# Altium schematic sheet atmg32.SchDoc
size A; SheetNumber: 1; SheetTotal: 1
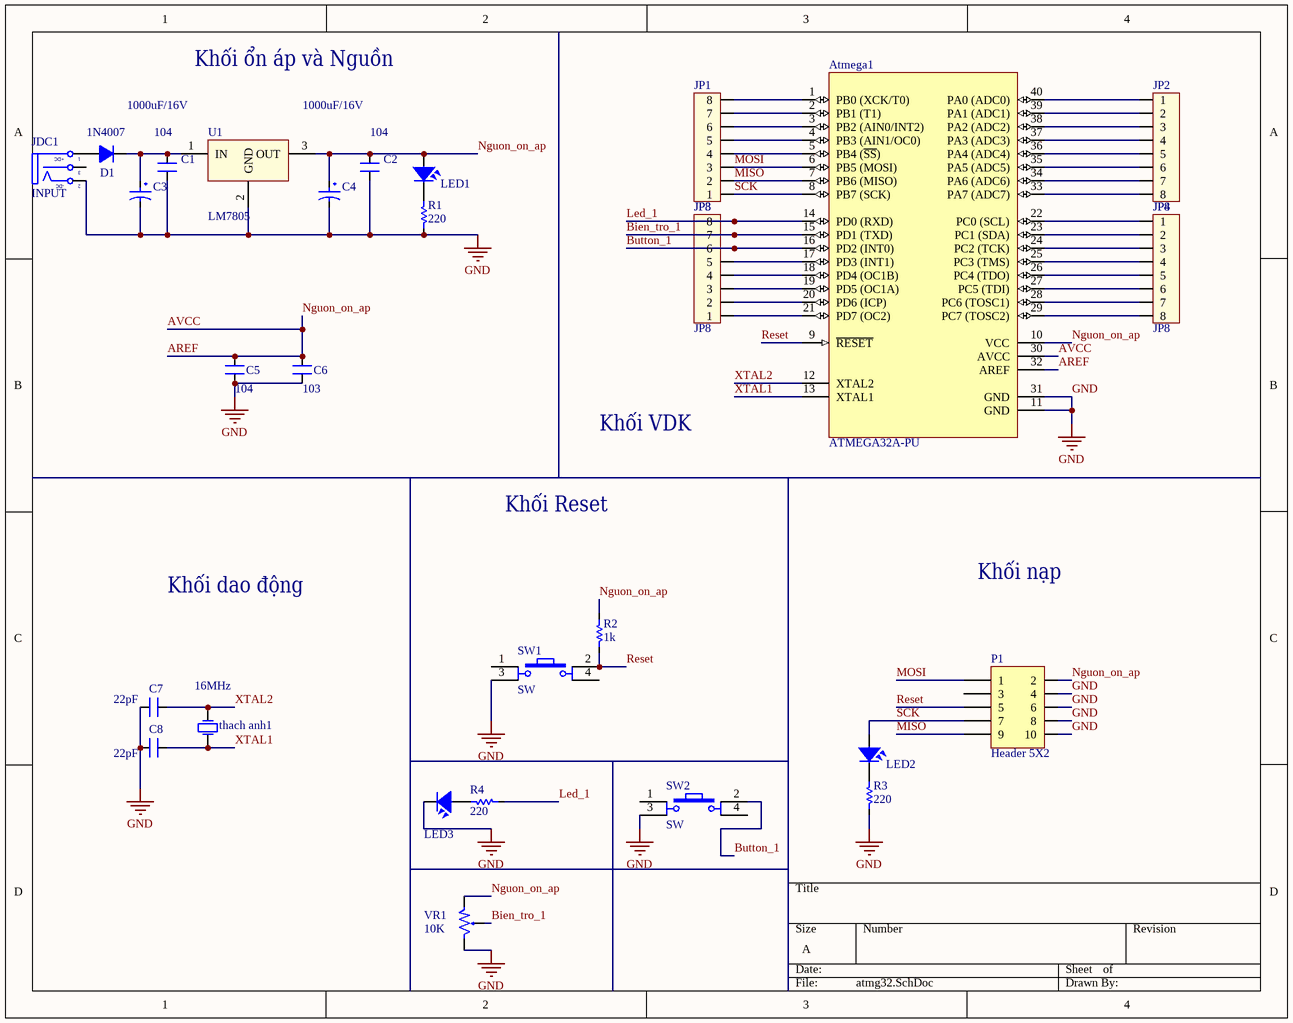
[diagram p0: atmg32.SchDoc]

## Parts
Atmega1  ATMEGA32A-PU  [DIP 40]
C1  104  [CN0]
C2  104  [CN0]
C3  1000uF/16V  [CAP 10x16x5 CURVE]
C4  1000uF/16V  [CAP 10x16x5 CURVE]
C5  104  [CN0]
C6  103  [CN0]
C7  22pF  [CN0]
C8  22pF  [CN0]
D1  1N4007  [1N4007]
JDC1  INPUT  [DC-IN]
JP1  JP8  [XH2.54-8P]
JP2  JP8  [XH2.54-8P]
JP3  JP8  [XH2.54-8P]
JP4  JP8  [XH2.54-8P]
LED1  LED  [LED-5MM-WHITE]  (value not drawn)
LED2  LED  [LED-5MM-WHITE]  (value not drawn)
LED3  LED  [LED-5MM-WHITE]  (value not drawn)
P1  Header 5X2  [HDR2X5]
R1  220  [RES-1/4W]
R2  1k  [RES-1/4W]
R3  220  [RES-1/4W]
R4  220  [RES-1/4W]
SW1  SW  [BUTTON 12x12x5 4P DIP]
SW2  SW  [BUTTON 12x12x5 4P DIP]
thach_anh1  16MHz  [CRYSTAL DIP]
U1  LM7805  [TO 220+Heatsink 21x15x10mm]
VR1  10K  [VR-RM065]

## Nets
GND: Atmega1.11(GND) Atmega1.31(GND) C1.1 C2.1 C3.2 C4.2 C5.1 C6.1 C7.2 C8.2 JDC1.2(TN) LED3.2 P1.4 P1.6 P1.8 P1.10 R1.1 R3.1 SW1.3 SW2.3 U1.2(GND) VR1.3
AREF: Atmega1.10(VCC) Atmega1.30(AVCC) Atmega1.32(AREF) C2.2 C4.1 C5.2 C6.2 LED1.1 P1.2 R2.2 U1.3(OUT) VR1.1  [also labelled AVCC, Nguon_on_ap]
Bien_tro_1: Atmega1.15(PD1_(TXD)) JP3.7 VR1.2
Button_1: Atmega1.16(PD2_(INT0)) JP3.6 SW2.2
Led_1: Atmega1.14(PD0_(RXD)) JP3.8 R4.1
MISO: Atmega1.7(PB6_(MISO)) JP1.2 P1.9
MOSI: Atmega1.6(PB5_(MOSI)) JP1.3 P1.1
Reset: Atmega1.9(~{RESET}) P1.5 R2.1 SW1.2
SCK: Atmega1.8(PB7_(SCK)) JP1.1 LED2.1 P1.7
XTAL1: Atmega1.13(XTAL1) C8.1 thach_anh1.1(OSC1)
XTAL2: Atmega1.12(XTAL2) C7.1 thach_anh1.2(OSC2)
NetAtmega1_1: Atmega1.1(PB0_(XCK/T0)) JP1.8
NetAtmega1_2: Atmega1.2(PB1_(T1)) JP1.7
NetAtmega1_3: Atmega1.3(PB2_(AIN0/INT2)) JP1.6
NetAtmega1_4: Atmega1.4(PB3_(AIN1/OC0)) JP1.5
NetAtmega1_5: Atmega1.5(PB4_(~{SS})) JP1.4
NetAtmega1_17: Atmega1.17(PD3_(INT1)) JP3.5
NetAtmega1_18: Atmega1.18(PD4_(OC1B)) JP3.4
NetAtmega1_19: Atmega1.19(PD5_(OC1A)) JP3.3
NetAtmega1_20: Atmega1.20(PD6_(ICP)) JP3.2
NetAtmega1_21: Atmega1.21(PD7_(OC2)) JP3.1
NetAtmega1_22: Atmega1.22(PC0_(SCL)) JP4.1
NetAtmega1_23: Atmega1.23(PC1_(SDA)) JP4.2
NetAtmega1_24: Atmega1.24(PC2_(TCK)) JP4.3
NetAtmega1_25: Atmega1.25(PC3_(TMS)) JP4.4
NetAtmega1_26: Atmega1.26(PC4_(TDO)) JP4.5
NetAtmega1_27: Atmega1.27(PC5_(TDI)) JP4.6
NetAtmega1_28: Atmega1.28(PC6_(TOSC1)) JP4.7
NetAtmega1_29: Atmega1.29(PC7_(TOSC2)) JP4.8
NetAtmega1_33: Atmega1.33(PA7_(ADC7)) JP2.8
NetAtmega1_34: Atmega1.34(PA6_(ADC6)) JP2.7
NetAtmega1_35: Atmega1.35(PA5_(ADC5)) JP2.6
NetAtmega1_36: Atmega1.36(PA4_(ADC4)) JP2.5
NetAtmega1_37: Atmega1.37(PA3_(ADC3)) JP2.4
NetAtmega1_38: Atmega1.38(PA2_(ADC2)) JP2.3
NetAtmega1_39: Atmega1.39(PA1_(ADC1)) JP2.2
NetAtmega1_40: Atmega1.40(PA0_(ADC0)) JP2.1
NetC1_2: C1.2 C3.1 D1.2(K) U1.1(IN)
NetD1_1: D1.1(A) JDC1.1(T)
NetLED1_2: LED1.2 R1.2
NetLED2_2: LED2.2 R3.2
NetLED3_1: LED3.1 R4.2

Not connected (* = marked no-connect by the designer): JDC1 3(S); P1 3; SW1 1 4; SW2 1 4

## Notes on the sheet
- Khối ổn áp và Nguồn
- Khối VDK
- Khối Reset
- Khối dao động
- Khối nạp
- (in symbol DCIN) +DC; -DC

## Library data of the parts
Atmega1 = ATMEGA32A-PU: 8-Bit AVR Microcontroller with 32K Bytes of In-System Programmable Flash Memory; Published: 17-Sep-2003; LatestRevisionDate: 04-Mar-2005; LatestRevisionNote: Stylized 3D Model Added.; DatasheetVersion: 2503C-AVR-10/02; PackageVersion: Dec-1999; PackageReference: 40P6; Publisher: Altium Limited; PackageDescription: DIP; 40 Leads; Row Spacing 15.24 mm; Pitch 2.54 mm; ComponentLink1Description: Manufacturer Link; ComponentLink1URL: http://www.atmel.com; ComponentLink2Description: Datasheet; ComponentLink2URL: http://www.atmel.com/dyn/resources/prod_documents/doc2503.pdf
C1 C2 C5-C8 = CN0: Ceramic capacitor; Value: 33pF
C3 C4 = CAP 10x16mm
D1 = 1N4007: Diode 1N4007 1A 1000V; Value: 1N4148
JDC1 = DCIN: Jac DC input; Value: Jac DC
JP1-JP4 = Con8: Header duc 8, Connector 8, Header 8; Value: Connector 8
LED1-LED3 = LED: LED Single; Value: LED 3 ly Single Colour
P1 = Header 5X2: Header, 5-Pin, Dual row; LatestRevisionDate: 17-Jul-2002; LatestRevisionNote: Re-released for DXP Platform.; Publisher: Altium Limited
R1-R4 = Res1/4W: Tro cam
SW1 SW2 = SW4 12x12: Switch button 4 pin 12x12mm; Value: Button chip 4 pin
thach_anh1 = Crystal: Thach anh; Published: 8-Jun-2000; LatestRevisionDate: 17-Jul-2002; LatestRevisionNote: Re-released for DXP Platform.; PackageReference: R38; Publisher: Altium Limited
U1 = LM78xx: On ap +, from + 5 to + 24VDC; Value: LM7805
VR1 = VR: Var Resistor; Value: VR 10K